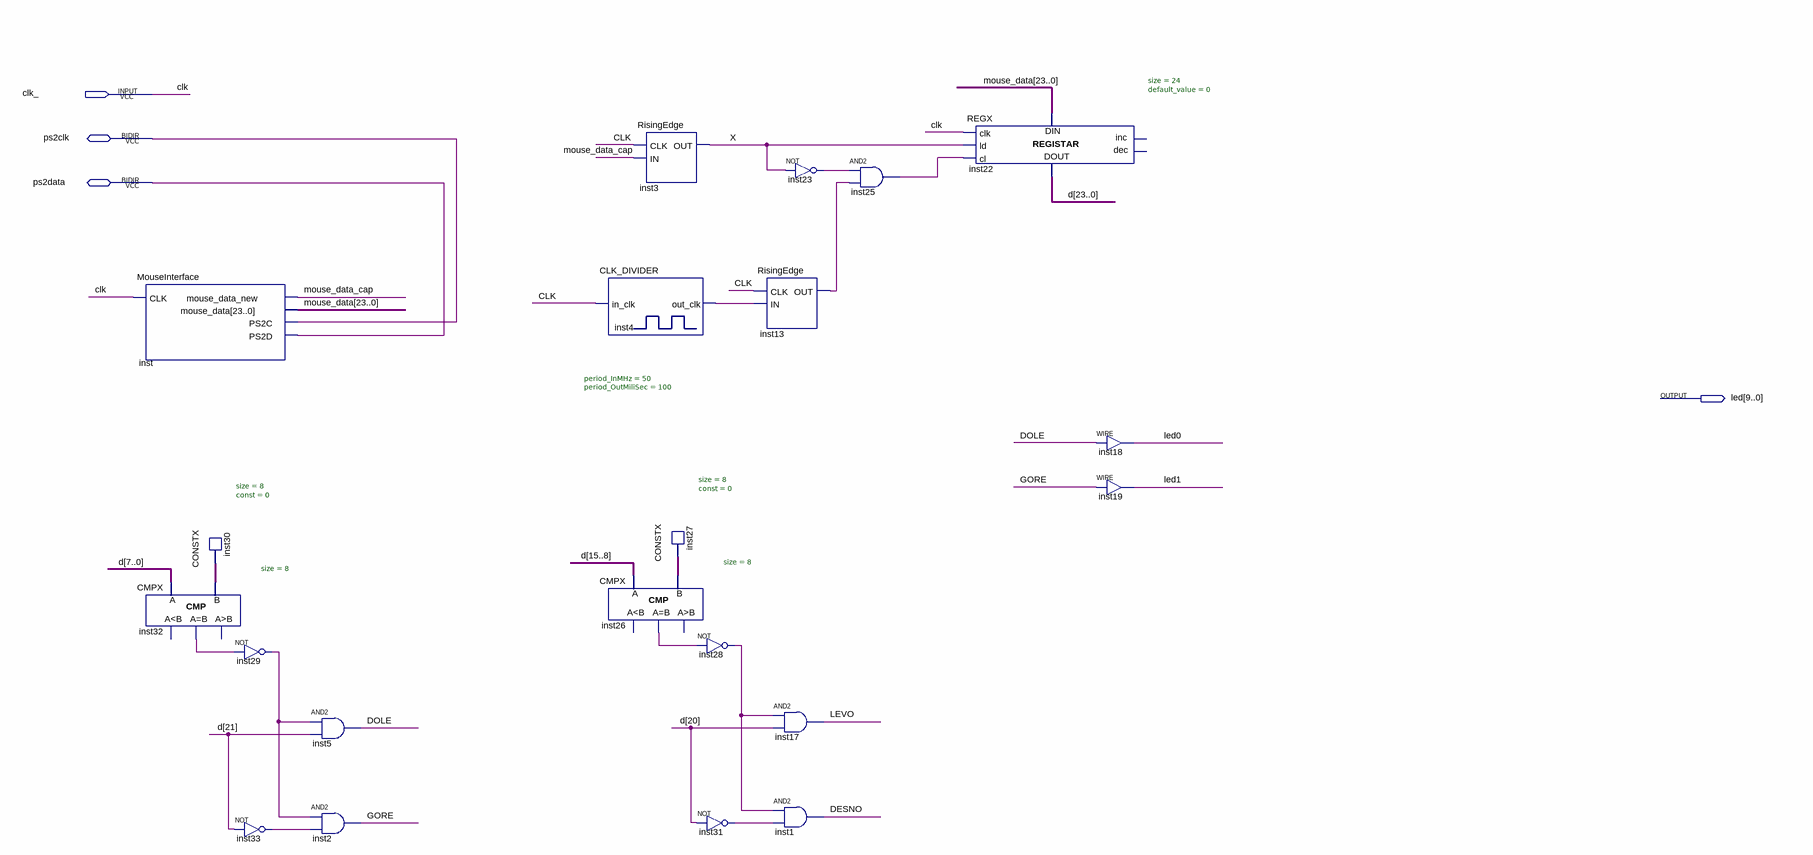
[diagram p0: schematic sheet]
// Quartus schematic mouse.bdf as structural Verilog: 21 symbols, 4 pins
module mouse (
  input  clk_,
  inout  ps2clk,
  inout  ps2data,
  output [9:0] led
);

  wire DESNO, DOLE, GORE, inst4_out_clk, inst13_out, inst23_out, inst25_out, inst26_eq, inst28_out,
       inst29_out, inst31_out, inst32_eq, inst33_out, LEVO, mouse_data_cap, X;
  wire [7:0] inst27_data, inst30_data;
  wire [23:0] d, mouse_data;

  MouseInterface inst (
    .CLK(clk_), .mouse_data_new(mouse_data_cap), .mouse_data(mouse_data), .PS2C(ps2clk), .PS2D(ps2data));
  CMPX #(.size(8)) inst32 (.A(d[7:0]), .B(inst30_data), .eq(inst32_eq));  // open: ls, gr
  CONSTX #(.size(8), .\const (0)) inst30 (.data(inst30_data));
  not inst29 (inst29_out, inst32_eq);
  not inst33 (inst33_out, d[21]);
  and inst5 (DOLE, inst29_out, d[21]);
  and inst2 (GORE, inst29_out, inst33_out);
  RisingEdge inst3 (.CLK(clk_), .IN(mouse_data_cap), .OUT(X));
  CLK_DIVIDER #(.period_InMHz(50), .period_OutMiliSec(100)) inst4 (.in_clk(clk_), .out_clk(inst4_out_clk));
  CMPX #(.size(8)) inst26 (.A(d[15:8]), .B(inst27_data), .eq(inst26_eq));  // open: ls, gr
  CONSTX #(.size(8), .\const (0)) inst27 (.data(inst27_data));
  not inst28 (inst28_out, inst26_eq);
  not inst31 (inst31_out, d[20]);
  not inst23 (inst23_out, X);
  RisingEdge inst13 (.CLK(clk_), .IN(inst4_out_clk), .OUT(inst13_out));
  and inst17 (LEVO, inst28_out, d[20]);
  and inst1 (DESNO, inst28_out, inst31_out);
  and inst25 (inst25_out, inst23_out, inst13_out);
  REGX #(.size(24), .default_value(0)) inst22 (
    .clk(clk_), .ld(X), .cl(inst25_out), .data_in(mouse_data), .data_out(d));  // open: inc, dec
  assign led[0] = DOLE;  // WIRE inst18
  assign led[1] = GORE;  // WIRE inst19

  // Other names for the same wires on the sheet: clk = clk_
endmodule
